# Altium schematic sheet SIM_INTERFACE.SchDoc
size A; SheetNumber: 13; SheetTotal: 28
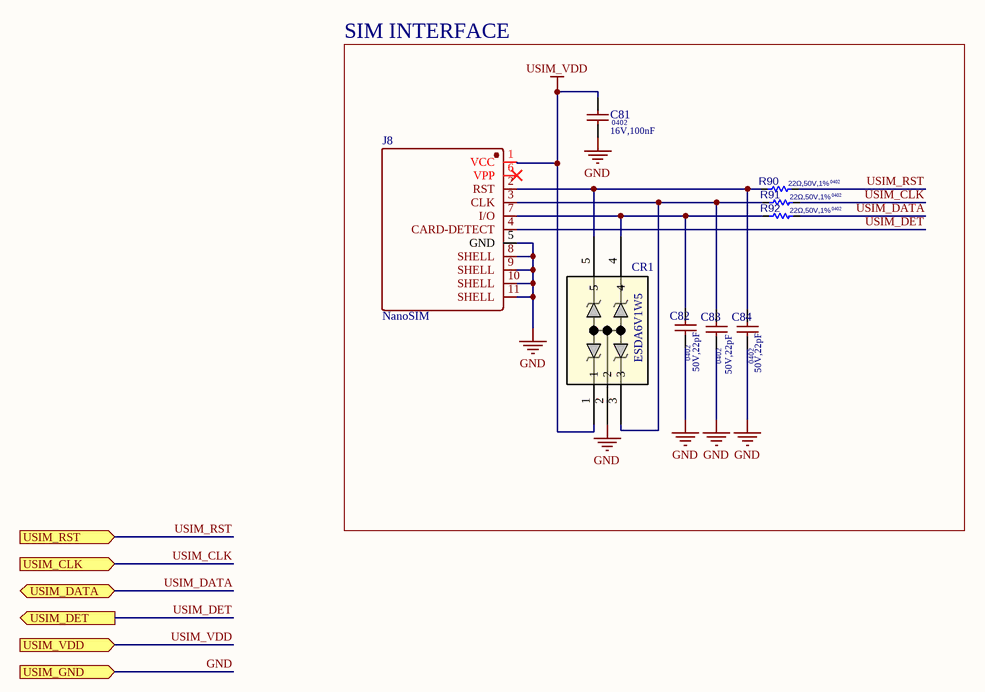
[diagram p0: SIM_INTERFACE.SchDoc]

## Parts
C81  value 16V,100nF  Package: 0402  [C0402]  (hidden comment: 100nf)
C82  value 50V,22pF  Package: 0402  [C0402]  (hidden comment: 22pF)
C83  value 50V,22pF  Package: 0402  [C0402]  (hidden comment: 22pF)
C84  value 50V,22pF  Package: 0402  [C0402]  (hidden comment: 22pF)
CR1  ESDA6V1W5  [SOT323-5L_STM]
J8  NanoSIM  [XKNANO-113]
R90  value 22Ω,50V,1%  Package: 0402  [R0402]  (hidden comment: 100KΩ)
R91  value 22Ω,50V,1%  Package: 0402  [R0402]  (hidden comment: 100KΩ)
R92  value 22Ω,50V,1%  Package: 0402  [R0402]  (hidden comment: 100KΩ)

## Blocks framed on the sheet
SIM INTERFACE: C81-C84 CR1 J8 R90-R92

## Ports
USIM_CLK (in), USIM_DATA (bidir), USIM_DET (out), USIM_GND (in), USIM_RST (in), USIM_VDD (in)

## Nets
GND: C81.1 C82.1 C83.1 C84.1 CR1.2 J8.5(GND) J8.8(SHELL) J8.9(SHELL) J8.10(SHELL) J8.11(SHELL) ; port USIM_GND
USIM_VDD: C81.2 CR1.1 J8.1(VCC) ; port USIM_VDD
USIM_CLK: R91.2 ; port USIM_CLK
USIM_DATA: R92.2 ; port USIM_DATA
USIM_DET: J8.4(CARD-DETECT) ; port USIM_DET
USIM_RST: R90.2 ; port USIM_RST
NetC82_2: C82.2 CR1.4 J8.7(I/O) R92.1
NetC83_2: C83.2 CR1.3 J8.3(CLK) R91.1
NetC84_2: C84.2 CR1.5 J8.2(RST) R90.1

Not connected (* = marked no-connect by the designer): J8 6(VPP)*

## Library data of the parts
C81 = CL05B104KO5NNNC: 16V 100nF X7R ±10% 0402 Multilayer Ceramic Capacitors MLCC - SMD/SMT ROHS; Manufacturer: KEMET; MPN: CC0603KRX7R9BB104; Datasheet: http://componentsearchengine.com/Datasheets/3/CC0603KRX7R9BB104.pdf; LCSC: C1525
C82-C84 = 0402CG220J500NT: 50V 22pF C0G ±5% 0402 Multilayer Ceramic Capacitors MLCC - SMD/SMT ROHS; Manufacturer: KEMET; MPN: CC0603KRX7R9BB104; Datasheet: http://componentsearchengine.com/Datasheets/3/CC0603KRX7R9BB104.pdf; LCSC: C1555
CR1 = ESDA6V1W5: Clamp Ipp Tvs Diode Surface Mount SOT-323-5; Manufacturer: STMicroelectronics; RefDes: RefDes; Type: Type; MPN: ESDA6V1W5; LCSC: C48677; Package: SOT-353-5L
J8 = XKNANO-113: Copper Alloy Self bomb Gold plating 1.25mm Deck -40℃~+85℃ 260℃ NanoSIM SMD SIM Card Connectors ROHS; Datasheet Link: https://datasheet.lcsc.com/lcsc/2110151630_XKB-Connection-XKNANO-113_C381071.pdf; LCSC: C381071; MPN: XKNANO-113
R90-R92 = RC0402FR-0722RL: 62.5mW Thick Film Resistors 50V ±100ppm/℃ ±1% 22Ω 0402 Chip Resistor - Surface Mount ROHS; Manufacturer: YAGEO; Max Operating Temp: +155; Type: *; Datasheet: https://datasheet.lcsc.com/lcsc/2304140030_YAGEO-RC0402FR-0722RL_C114765.pdf; MPN: RC0402FR-0722RL; Min Operating Temp: -55; LCSC: C114765